# EAGLE design 99 (EAGLE 9.6.1)
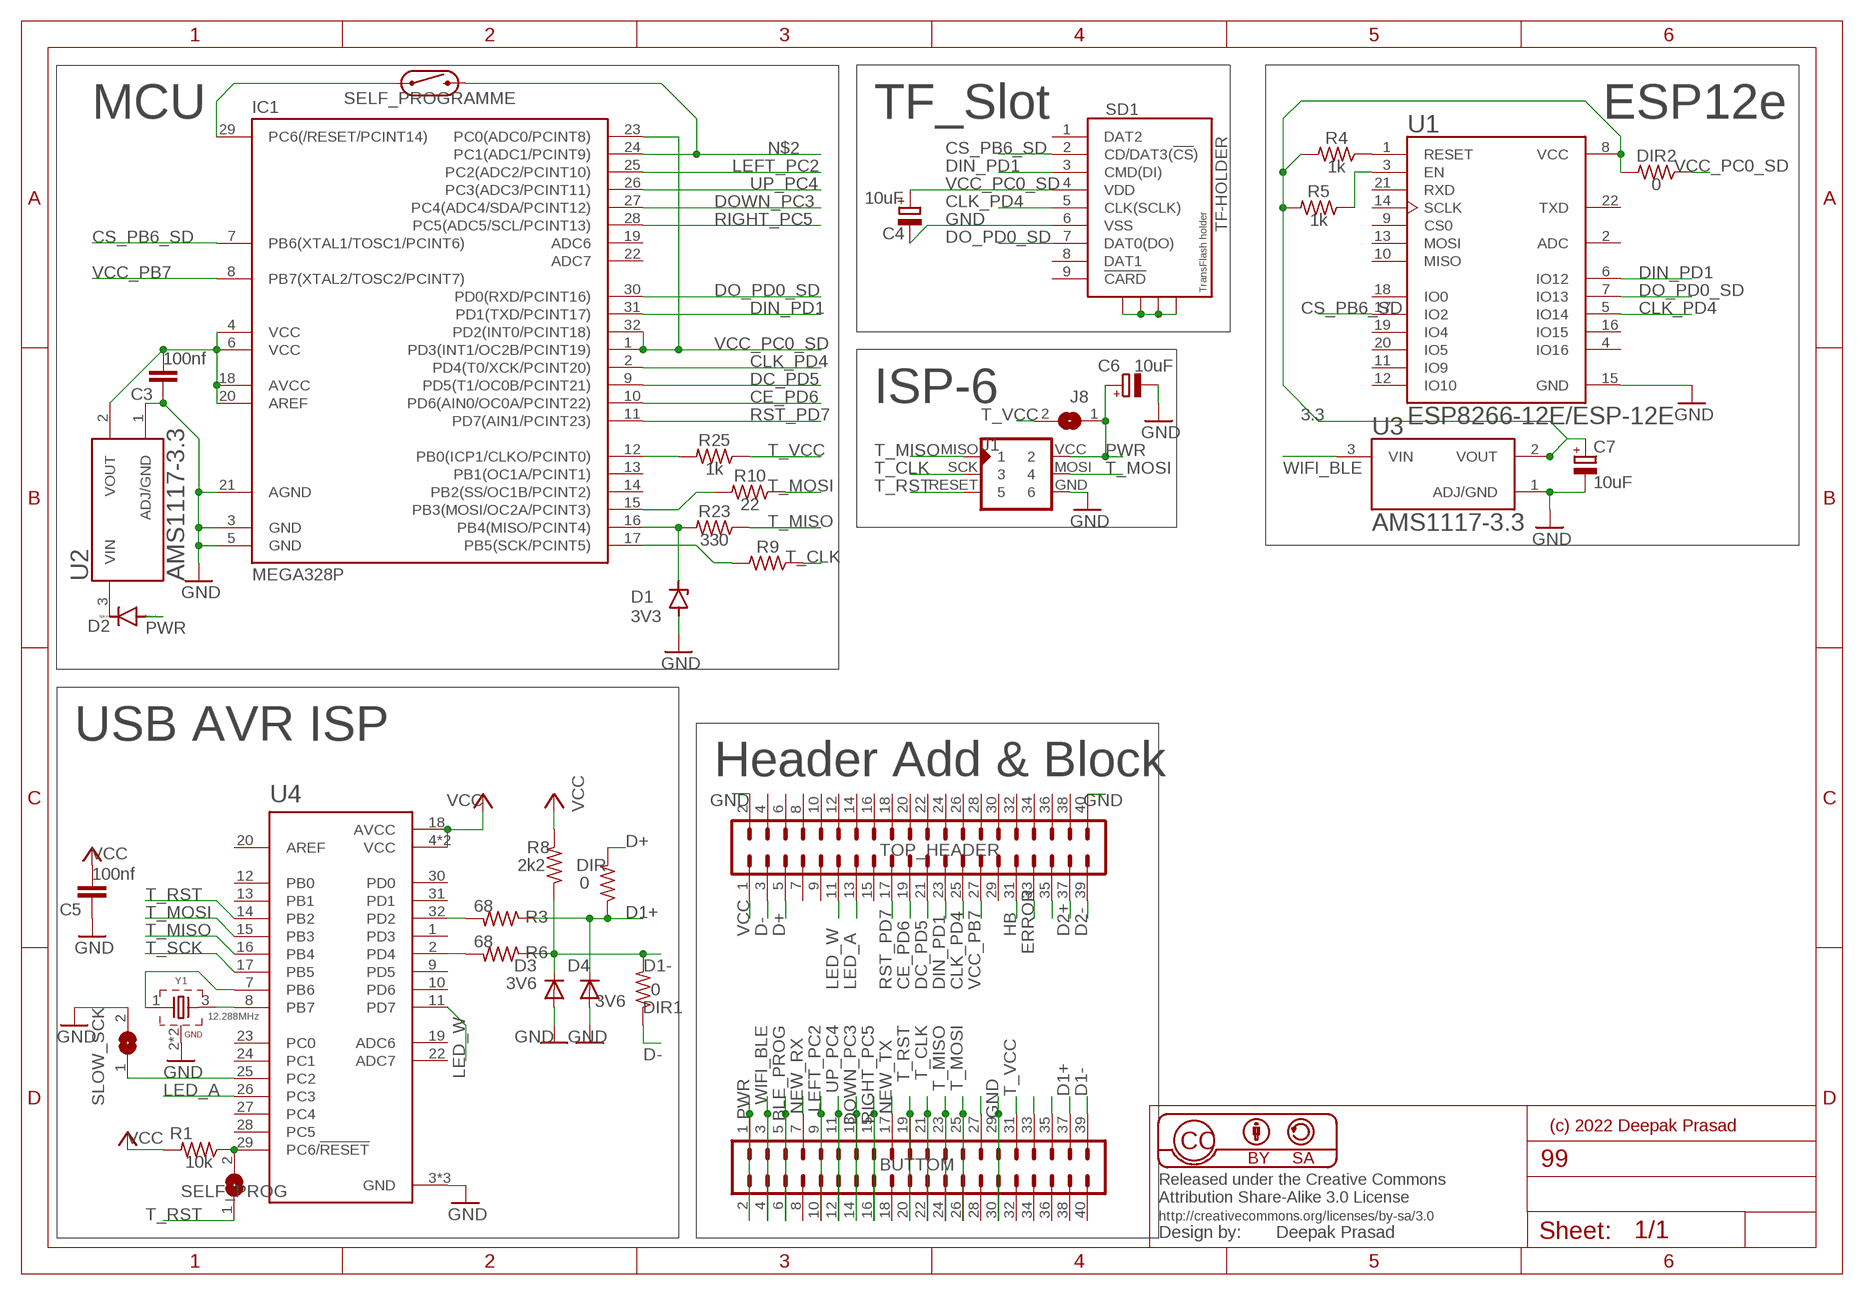
[diagram p0: schematic, sheet 1]

## Parts
BUTTOM  MA20-2  [MA20-2]
C3  100nf  C-EUC1206  [C1206]
C4  10uF  CPOL-EUC/6032-28R  [C/6032-28R]
C5  100nf  C-EUC1206  [C1206]
C6  10uF  CPOL-EUC/6032-28R  [C/6032-28R]
C7  10uF  CPOL-EUC/6032-28R  [C/6032-28R]
D1  3V3  ZENER-DIODESOD80C  [SOD80C]
D2  DIODE-DO214AC  [DO214AC]
D3  3V6  DIODESMA  [SMA-DIODE]
D4  3V6  DIODESMA  [SMA-DIODE]
DIR  0  R-US_CHIP-1206(3216-METRIC)  [RESC3216X70]
DIR1  0  R-US_CHIP-1206(3216-METRIC)  [RESC3216X70]
DIR2  0  R-US_CHIP-1206(3216-METRIC)  [RESC3216X70]
IC1  MEGA328P  MEGA48/88/168-AU  [TQFP32-08]
J1  AVR-ISP-6PINAVR-ISP-6PIN  [AVR-ISP-6PIN]
J8  SJW  [SJW]
R1  10k  R-US_CHIP-1206(3216-METRIC)  [RESC3216X70]
R3  68  R-US_CHIP-1206(3216-METRIC)  [RESC3216X70]
R4  1k  R-US_CHIP-1206(3216-METRIC)  [RESC3216X70]
R5  1k  R-US_CHIP-1206(3216-METRIC)  [RESC3216X70]
R6  68  R-US_CHIP-1206(3216-METRIC)  [RESC3216X70]
R8  2k2  R-US_CHIP-1206(3216-METRIC)  [RESC3216X70]
R9  22  R-US_CHIP-1206(3216-METRIC)  [RESC3216X70]
R10  22  R-US_CHIP-1206(3216-METRIC)  [RESC3216X70]
R23  330  R-US_CHIP-1206(3216-METRIC)  [RESC3216X70]
R25  1k  R-US_CHIP-1206(3216-METRIC)  [RESC3216X70]
SD1  TF-HOLDER  [TF-PULL]
SELF_PROG  SJW  [SJW]
SELF_PROGRAMME  REED_SWITCH-PTH-GLASS  [REED_SWITCH_GLASS]
SLOW_SCK  SJW  [SJW]
TOP_HEADER  MA20-2  [MA20-2]
U1  ESP8266-12E/ESP-12E  [XCVR_ESP8266-12E/ESP-12E]
U2  AMS1117-3.3  [SOT229P700X180-4N]
U3  AMS1117-3.3  [SOT229P700X180-4N]
U4  ATMEGA328P-AU  [QFP80P900X900X120-32N]
Y1  12.288MHz  WE-XTAL_CFPX-104_830059523  [WE-XTAL_CFPX-104]

## Nets
3.3: C7.+ DIR2.2 R4.2 R5.2 U1.8(VCC) U3.2(VOUT)
BLE_PROG: BUTTOM.5 BUTTOM.6
CE_PD6: IC1.10(PD6(AIN0/OC0A/PCINT22)) TOP_HEADER.19
CLK_PD4: IC1.2(PD4(T0/XCK/PCINT20)) SD1.5(CLK(SCLK)) TOP_HEADER.25 U1.5(IO14)
CS_PB6_SD: IC1.7(PB6(XTAL1/TOSC1/PCINT6)) SD1.2(CD/DAT3(!CS!)) U1.17(IO2)
D1+: BUTTOM.37 D4.C DIR.1 R3.1
D1-: BUTTOM.39 D3.C DIR1.2 R6.1 R8.1
D2+: TOP_HEADER.37
D2-: TOP_HEADER.39
D+: DIR.2 TOP_HEADER.5
D-: DIR1.1 TOP_HEADER.3
DC_PD5: IC1.9(PD5(T1/OC0B/PCINT21)) TOP_HEADER.21
DIN_PD1: IC1.31(PD1(TXD/PCINT17)) SD1.3(CMD(DI)) TOP_HEADER.23 U1.6(IO12)
DO_PD0_SD: IC1.30(PD0(RXD/PCINT16)) SD1.7(DAT0(DO)) U1.7(IO13)
DOWN_PC3: BUTTOM.13 BUTTOM.14 IC1.27(PC4(ADC4/SDA/PCINT12))
ERROR: TOP_HEADER.33
GND [POWER]: BUTTOM.29 BUTTOM.30 C3.1 C4.- C5.1 C6.- C7.- D1.A D3.A D4.A IC1.3(GND) IC1.5(GND) IC1.21(AGND) J1.GND SD1.6(VSS) SLOW_SCK.2 TOP_HEADER.2 TOP_HEADER.40 U1.15(GND) U2.1(ADJ/GND) U3.1(ADJ/GND) U4.3(GND) U4.5(GND) U4.21(GND) Y1.2(GND) Y1.4(GND)
GND1: SD1.S1 SD1.S2 SD1.S3 SD1.S4
HB: TOP_HEADER.31
LED_A: TOP_HEADER.13 U4.26(PC3)
LED_W: TOP_HEADER.11 U4.11(PD7)
LEFT_PC2: BUTTOM.9 BUTTOM.10 IC1.25(PC2(ADC2/PCINT10))
N$1: U4.8(PB7) Y1.3
N$2: IC1.24(PC1(ADC1/PCINT9)) SELF_PROGRAMME.P$2
N$3: R4.1 U1.1(RESET)
N$5: R5.1 U1.3(EN)
N$6: IC1.12(PB0(ICP1/CLKO/PCINT0)) R25.2
N$7: D1.C IC1.16(PB4(MISO/PCINT4)) R23.2
N$8: U4.7(PB6) Y1.1
N$9: C3.2 IC1.4(VCC) IC1.6(VCC) IC1.18(AVCC) IC1.20(AREF) U2.2(VOUT)
N$10: R1.1 SELF_PROG.2 U4.29(PC6/!RESET)
N$11: D2.C U2.3(VIN)
N$12: IC1.29(PC6(/RESET/PCINT14)) SELF_PROGRAMME.P$1
N$13: SLOW_SCK.1 U4.25(PC2)
N$16: R3.2 U4.32(PD2)
N$19: R6.2 U4.2(PD4)
N$21: IC1.15(PB3(MOSI/OC2A/PCINT3)) R10.2
N$22: IC1.17(PB5(SCK/PCINT5)) R9.2
N$32: TOP_HEADER.35
N$41: BUTTOM.27
N$44: BUTTOM.33
N$45: BUTTOM.35
NEW_RX: BUTTOM.7
NEW_TX: BUTTOM.17
PWR: BUTTOM.1 BUTTOM.2 C6.+ D2.A J1.VCC J8.1
RIGHT_PC5: BUTTOM.15 BUTTOM.16 IC1.28(PC5(ADC5/SCL/PCINT13))
RST_PD7: IC1.11(PD7(AIN1/PCINT23)) TOP_HEADER.17
T_CLK: BUTTOM.21 BUTTOM.22 J1.SCK R9.1
T_MISO: BUTTOM.23 BUTTOM.24 J1.MISO R23.1 U4.16(PB4)
T_MOSI: BUTTOM.25 BUTTOM.26 J1.MOSI R10.1 U4.15(PB3)
T_RST: BUTTOM.19 BUTTOM.20 J1.RESET SELF_PROG.1 U4.14(PB2)
T_SCK: U4.17(PB5)
T_VCC: BUTTOM.31 J8.2 R25.1
UP_PC4: BUTTOM.11 BUTTOM.12 IC1.26(PC3(ADC3/PCINT11))
VCC [POWER]: C5.2 R1.2 R8.2 TOP_HEADER.1 U4.4(VCC) U4.6(VCC) U4.18(AVCC)
VCC_PB7: IC1.8(PB7(XTAL2/TOSC2/PCINT7)) TOP_HEADER.27
VCC_PC0_SD: C4.+ DIR2.1 IC1.1(PD3(INT1/OC2B/PCINT19)) IC1.23(PC0(ADC0/PCINT8)) IC1.32(PD2(INT0/PCINT18)) SD1.4(VDD)
WIFI_BLE: BUTTOM.3 BUTTOM.4 U3.3(VIN)
Unconnected: BUTTOM.8 BUTTOM.18 BUTTOM.28 BUTTOM.32 BUTTOM.34 BUTTOM.36 BUTTOM.38 BUTTOM.40 IC1.13(PB1(OC1A/PCINT1)) IC1.14(PB2(SS/OC1B/PCINT2)) IC1.19(ADC6) IC1.22(ADC7) SD1.1(DAT2) SD1.8(DAT1) SD1.9(!CARD) TOP_HEADER.4 TOP_HEADER.6 TOP_HEADER.7 TOP_HEADER.8 TOP_HEADER.9 TOP_HEADER.10 TOP_HEADER.12 TOP_HEADER.14 TOP_HEADER.15 TOP_HEADER.16 TOP_HEADER.18 TOP_HEADER.20 TOP_HEADER.22 TOP_HEADER.24 TOP_HEADER.26 TOP_HEADER.28 TOP_HEADER.29 TOP_HEADER.30 TOP_HEADER.32 TOP_HEADER.34 TOP_HEADER.36 TOP_HEADER.38 U1.2(ADC) U1.4(IO16) U1.9(CS0) U1.10(MISO) U1.11(IO9) U1.12(IO10) U1.13(MOSI) U1.14(SCLK) U1.16(IO15) U1.18(IO0) U1.19(IO4) U1.20(IO5) U1.21(RXD) U1.22(TXD) U4.1(PD3) U4.9(PD5) U4.10(PD6) U4.12(PB0) U4.13(PB1) U4.19(ADC6) U4.20(AREF) U4.22(ADC7) U4.23(PC0) U4.24(PC1) U4.27(PC4) U4.28(PC5) U4.30(PD0) U4.31(PD1)

## Notes on the sheet
- MCU | TF_Slot | ESP12e
- ISP-6
- USB AVR ISP
- Header Add & Block
- (c) 2022 Deepak Prasad

## Library data of the parts
BUTTOM TOP_HEADER = con-lstb:MA20-2: PIN HEADER; OC_FARNELL: unknown; OC_NEWARK: unknown
C3 C5 = rcl:C-EU: CAPACITOR, European symbol; SPICEPREFIX: C
C4 C6 C7 = rcl:CPOL-EU: POLARIZED CAPACITOR, European symbol
D1 = diode:ZENER-DIODE: Z-Diode
D2 = diode:DIODE-: DIODE
D3 D4 = sparkfun:DIODE: Diode These are standard reverse protection diodes and small signal diodes. SMA package can handle up to about 1A. SOD-323 can handle about 200mA. What the SOD-323 package when ordering, there are some mfgs out there that are 5-pin packages.
DIR DIR1 DIR2 R1 R3-R6 R8-R10 R23 R25 = Resistor:R-US: Resistor Fixed - ANSI; CATEGORY: Resistor; SUB-CATEGORY: Fixed
IC1 = avr-6:MEGA48/88/168
J1 = avr-isp:AVR-ISP-6PIN: AVR ISP 6pin 3x2 pin header
J8 SELF_PROG SLOW_SCK = jumper:SJ: SMD solder JUMPER
SD1 = sd-mmc:TF-HOLDER: TF / Micro SD socket is PUSH-PUSH type, the card can be pushed into and auto locked and pushed out by simply press the card. Surface Mounting type.
SELF_PROGRAMME = SparkFun-Switches:REED_SWITCH: Reed Switch A reed switch is a magnetically-actuated switch. When the device is exposed to a magnetic field, the two ferrous materials inside the switch pull together and the switch closes. Variant Overview PTH-GLASS Reed Switch <https://www.sparkfun.com/products/8642> (COM-08642) - PTH reed switch w/ glass body (6.0 x 0.9 mm) PTH-INSULATED Reed Switch - Insulated <https://www.sparkfun.com/products/10601> (COM-10601) - PTH reed switch w/ insulated body (15.1 x 4.2 mm); PROD_ID: SWCH-09282; SF_SKU: COM-08642
U1 = ESP8266-12E_ESP-12E:ESP8266-12E/ESP-12E: ESP-12E WiFi Module Check availability <https://pricing.snapeda.com/parts/ESP8266-12E/ESP-12E/AI-Thinker/view-part?ref=eda>; AVAILABILITY: Not in stock; DESCRIPTION: This WiFi module has a 32-bit MCU micro and clock speeds supporting 80 MHz or 160 MHz. Supports the RTOS and integrated Wi-Fi MAC/BB/RF/PA/LNA, and has an on-board antenna.; MF: AI-Thinker; MP: ESP8266-12E/ESP-12E; PACKAGE: None; PRICE: None
U2 U3 = AMS1117-3.3:AMS1117-3.3: Sot223/Pkg 1-Amp 3.3-Volt Low Drop Out Voltage Regulatator Check availability <https://pricing.snapeda.com/parts/AMS1117-3.3/Advanced%20Monolithic%20Systems/view-part?ref=eda>; AVAILABILITY: In Stock; DESCRIPTION: Sot223/Pkg 1-Amp 3.3-Volt Low Drop Out Voltage Regulatator; MF: Advanced Monolithic Systems; MP: AMS1117-3.3; PACKAGE: SOT-223 Seeed Technology; PRICE: None
U4 = ATMEGA328P-AU:ATMEGA328P-AU: ATmega Series 20 MHz 32 KB Flash 2 KB SRAM 8-Bit Microcontroller - TQFP-32 Check availability <https://pricing.snapeda.com/parts/ATMEGA328P-AU/Microchip%20Technology/view-part?ref=eda>; AVAILABILITY: In Stock; DESCRIPTION: AVR AVR® ATmega Microcontroller IC 8-Bit 20MHz 32KB (16K x 16) FLASH 32-TQFP (7x7); MF: Microchip Technology; MP: ATMEGA328P-AU; PACKAGE: TQFP-32 Microchip; PRICE: None; PURCHASE-URL: https://pricing.snapeda.com/search/part/ATMEGA328P-AU/?ref=eda
Y1 = Wurth_Quartz Crystals & Oscillators_WE-XTAL:WE-XTAL_CFPX-104: WE-XTAL Quartz Crystal Characteristics SMT and THT models Hermetically sealed Frequencies between 1.8432 MHz and 50 MHz Tolerances down to ±10 ppm available Maximum operating temperatures range: -40 °C to 85 °C Stabilities down to ±10 ppm available Applications Microprocessor Wireless Communication Devices Industrial Devices Wired Communication (e.g. Ethernet and USB) IoT Optical Network Audio and Multimedia Devices Test and Measurement Equipment Navigation and Locators Wearables <https://www.we-online.com/catalog/media/o135919v209%20Family_WE-XTAL_IQXC-42.jpg> Details see: https://www.we-online.com/catalog/en/WE-XTAL Updated by Ella Wu , 2020-11-23 2020 (C) Wurth Elektronik; C-LOAD: 18pF; DATASHEET-URL: https://www.we-online.com/catalog/datasheet/830059523.pdf; MOUNT: SMT; PART-NUMBER: 830059523; STABILITY: 30ppm; TOLERANCE: ±20ppm

## Net classes
0 default: width 0.254 mm, clearance 0.254 mm
1 POWER: width 0.254 mm, clearance 0.254 mm

## Board
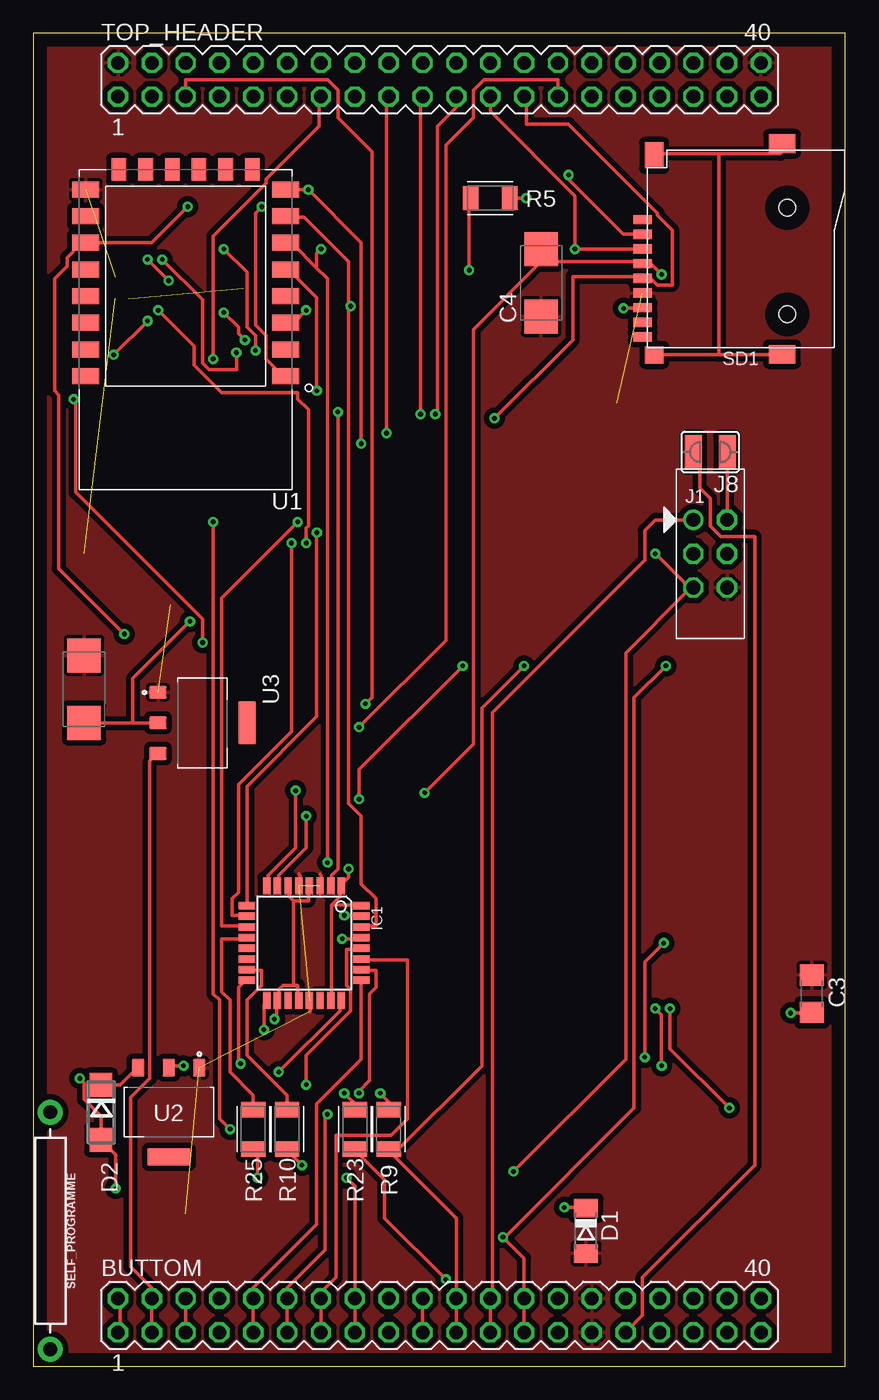
[diagram p1: board, top side]
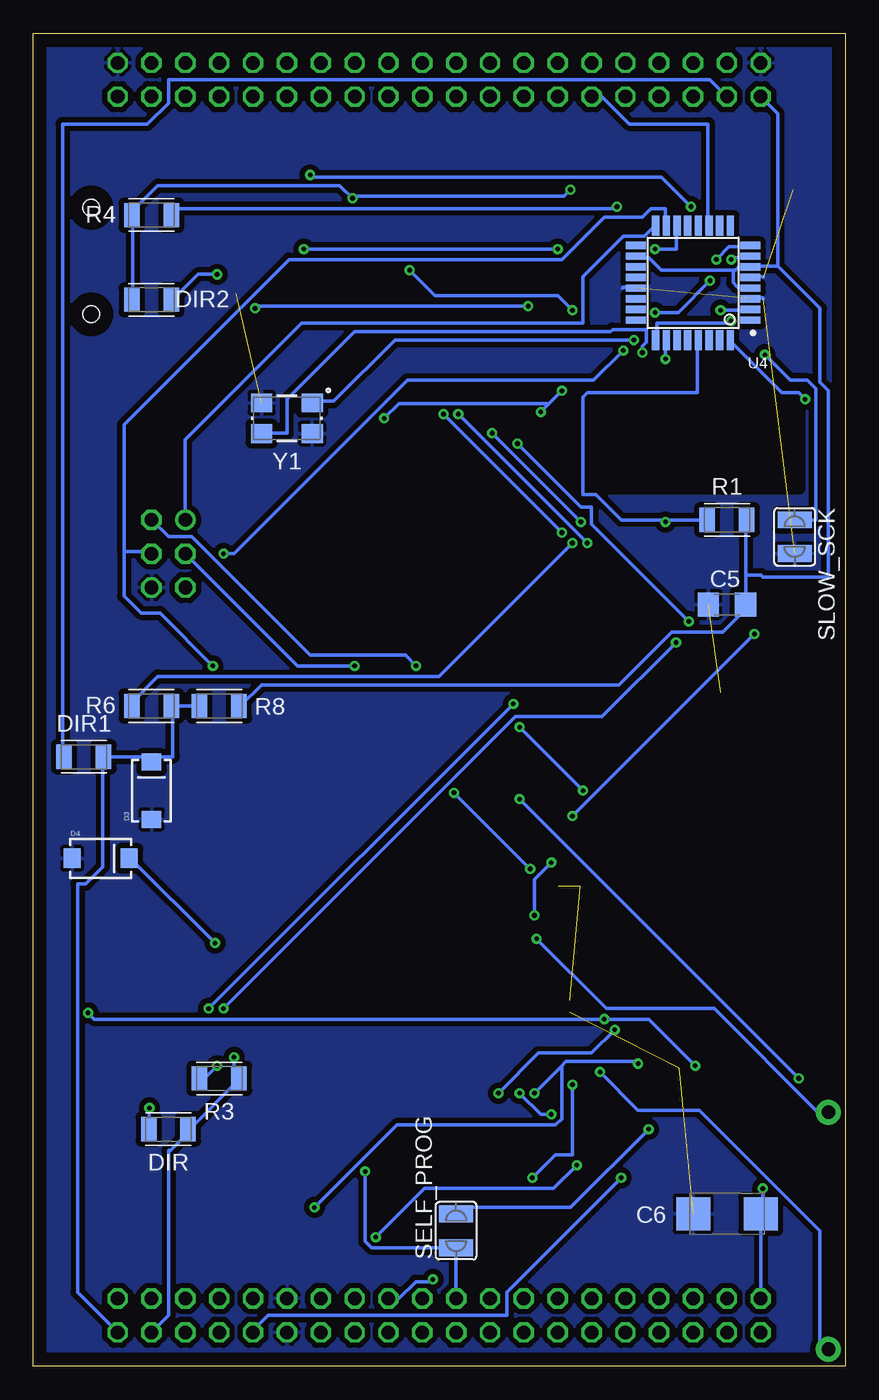
[diagram p2: board, bottom side, seen from below]

Size 60.94 x 100 mm. Coordinates in mm from the lower left corner, seen from the top.
Outline: 0,0 60.94,0 60.94,100 0,100 0,0
Copper layers (1*16): Top 0.035mm / dielectric 1.5mm / Bottom 0.035mm
Design rules "default": minimum track width 6mil, minimum drill 0.35mm, track to track 6mil, track to pad 6mil, pad to pad 6mil, via to via 6mil, smd to smd 6mil, copper to edge 40mil, drill to drill 6mil, minimum pad ring 10mil, minimum via ring 8mil, stop-mask expansion 4mil, vias tented up to drill 0mil, thermal gap 10mil

### Footprints (pad centres in the part's own frame; a part is rotated, then mirrored left to right if it is on the bottom)
MA20-2 = drill 1.016 octagon: 1 -24.13,-1.27; 2 -24.13,1.27; 3 -21.59,-1.27; 4 -21.59,1.27; 5 -19.05,-1.27; 6 -19.05,1.27; 7 -16.51,-1.27; 8 -16.51,1.27; 9 -13.97,-1.27; 10 -13.97,1.27; 11 -11.43,-1.27; 12 -11.43,1.27; 13 -8.89,-1.27; 14 -8.89,1.27; 15 -6.35,-1.27; 16 -6.35,1.27; 17 -3.81,-1.27; 18 -3.81,1.27; 19 -1.27,-1.27; 20 -1.27,1.27; 21 1.27,-1.27; 22 1.27,1.27; 23 3.81,-1.27; 24 3.81,1.27; 25 6.35,-1.27; 26 6.35,1.27; 27 8.89,-1.27; 28 8.89,1.27; 29 11.43,-1.27; 30 11.43,1.27; 31 13.97,-1.27; 32 13.97,1.27; 33 16.51,-1.27; 34 16.51,1.27; 35 19.05,-1.27; 36 19.05,1.27; 37 21.59,-1.27; 38 21.59,1.27; 39 24.13,-1.27; 40 24.13,1.27
C1206 = smd 1.6 x 1.8: 1 -1.4,0; 2 1.4,0
C/6032-28R = smd 2.55 x 2.5: + 2.525,0; - -2.525,0
SOD80C = smd 1.4 x 1.8: A 1.7,0; C -1.7,0
DO214AC = smd 1.8 x 1.7: A 2.05,0; C -2.05,0
SMA-DIODE = smd 1.27 x 1.47: A -2.15,0; C 2.15,0
RESC3216X70 = smd 1.165 x 1.815: 1 -1.475,0; 2 1.475,0
TQFP32-08 = smd 1.27 x 0.559: 1 -4.293,2.8; 2 -4.293,2; 3 -4.293,1.2; 4 -4.293,0.4; 5 -4.293,-0.4; 6 -4.293,-1.2; 7 -4.293,-2; 8 -4.293,-2.8; 17 4.293,-2.8; 18 4.293,-2; 19 4.293,-1.2; 20 4.293,-0.4; 21 4.293,0.4; 22 4.293,1.2; 23 4.293,2; 24 4.293,2.8 | smd 0.559 x 1.27: 9 -2.8,-4.293; 10 -2,-4.293; 11 -1.2,-4.293; 12 -0.4,-4.293; 13 0.4,-4.293; 14 1.2,-4.293; 15 2,-4.293; 16 2.8,-4.293; 25 2.8,4.293; 26 2,4.293; 27 1.2,4.293; 28 0.4,4.293; 29 -0.4,4.293; 30 -1.2,4.293; 31 -2,4.293; 32 -2.8,4.293
AVR-ISP-6PIN = drill 1.016 octagon: GND 1.27,-2.54; MOSI 1.27,0; RESET -1.27,-2.54; SCK -1.27,0; VCC 1.27,2.54 | drill 1.016: MISO -1.27,2.54
SJW = smd 1.27 x 2.54: 1 -1.27,0; 2 1.27,0
TF-PULL = smd 0.7 x 1.4: 1 -2.2,-7.62; 2 -1.1,-7.62; 3 0,-7.62; 4 1.1,-7.62; 5 2.2,-7.62; 6 3.3,-7.62; 7 4.4,-7.62; 8 5.5,-7.62; 9 6.6,-7.62 | smd 1.4 x 2: S1 -7.9,2.85; S2 7.9,2.85 | smd 1.28 x 1.4: S3 7.96,-6.75 | smd 1.95 x 1.4: S4 -7.025,-6.75 | hole 1.25: -3.1,3.25; 4.9,3.25
REED_SWITCH_GLASS = drill 1.016 pad 1.88: P$1 -8.89,0; P$2 8.89,0
XCVR_ESP8266-12E/ESP-12E = smd 2 x 1.2: 1 -7.5,7; 2 -7.5,5; 3 -7.5,3; 4 -7.5,1; 5 -7.5,-1; 6 -7.5,-3; 7 -7.5,-5; 8 -7.5,-7; 15 7.5,-7; 16 7.5,-5; 17 7.5,-3; 18 7.5,-1; 19 7.5,1; 20 7.5,3; 21 7.5,5; 22 7.5,7 | smd 1.1 x 1.7: 9 -5,-8.5; 10 -3,-8.5; 11 -1,-8.5; 12 1,-8.5; 13 3,-8.5; 14 5,-8.5
SOT229P700X180-4N = smd 0.93 x 1.31: 1 -2.29,-3.345; 2 0,-3.345; 3 2.29,-3.345 | smd 3.24 x 1.31: 4 0,3.345
QFP80P900X900X120-32N = smd 1.5 x 0.55: 1 -4.3,2.8; 2 -4.3,2; 3 -4.3,1.2; 4 -4.3,0.4; 5 -4.3,-0.4; 6 -4.3,-1.2; 7 -4.3,-2; 8 -4.3,-2.8; 17 4.3,-2.8; 18 4.3,-2; 19 4.3,-1.2; 20 4.3,-0.4; 21 4.3,0.4; 22 4.3,1.2; 23 4.3,2; 24 4.3,2.8 | smd 0.55 x 1.5: 9 -2.8,-4.3; 10 -2,-4.3; 11 -1.2,-4.3; 12 -0.4,-4.3; 13 0.4,-4.3; 14 1.2,-4.3; 15 2,-4.3; 16 2.8,-4.3; 25 2.8,4.3; 26 2,4.3; 27 1.2,4.3; 28 0.4,4.3; 29 -0.4,4.3; 30 -1.2,4.3; 31 -2,4.3; 32 -2.8,4.3
WE-XTAL_CFPX-104 = smd 1.6 x 1.4: 1 -1.9,-1.15; 2 1.9,-1.15; 3 1.9,1.15; 4 -1.9,1.15

### Placement (x,y rotation side)
BUTTOM  30.48,3.81 0 top
C3  58.42,27.94 270 top
C4  38.1,81.28 90 top
C5  8.89,57.15 0 bottom
C6  8.89,11.43 0 bottom
C7  3.81,50.8 270 top
D1  41.48,10.16 270 top
D2  5.08,19.05 270 top
D3  52.07,43.18 90 bottom
D4  55.88,38.1 0 bottom
DIR  50.8,17.78 180 bottom
DIR1  57.15,45.72 0 bottom
DIR2  52.07,80.01 180 bottom
IC1  20.32,31.75 270 top
J1  50.8,60.96 0 top
J8  50.8,68.58 180 top
R1  8.89,63.5 0 bottom
R3  46.99,21.59 180 bottom
R4  52.07,86.36 180 bottom
R5  34.29,87.63 0 top
R6  52.07,49.53 180 bottom
R8  46.99,49.53 0 bottom
R9  26.67,17.78 90 top
R10  19.05,17.78 90 top
R23  24.13,17.78 90 top
R25  16.51,17.78 90 top
SD1  53.34,83.82 270 top
SELF_PROG  29.21,10.16 90 bottom
SELF_PROGRAMME  1.27,10.16 270 top
SLOW_SCK  3.81,62.23 270 bottom
TOP_HEADER  30.48,96.52 0 top
U1  11.43,81.28 180 top
U2  10.16,19.05 180 top
U3  12.7,48.26 270 top
U4  11.43,81.28 180 bottom
Y1  41.91,71.12 180 bottom

### Tracks (layer width: path | path; a pad name or v marks a point on that pad's centre or on a via)
3.3  (via drill 0.35)
  Top 0.254: 7.46,48.26 C7.+ | 7.46,48.26 U3.2 | v36.99,87.63 R5.2 | U1.8 19.05,88.27 v20.64,88.27 24.61,84.3 v24.61,69.22 | 7.46,48.26 7.46,51.59 v11.75,55.88
  Bottom 0.254: 53.5,86.36 53.5,86.68 51.59,88.58 37.94,88.58 v36.99,87.63 36.99,87.79 21.11,87.79 v20.64,88.27 | 53.5,86.36 53.5,80.01 DIR2.2 | 53.5,86.36 R4.2 | v11.75,55.88 19.05,63.18 19.05,64.45 19.84,64.45 v24.61,69.22
BLE_PROG
  Top 0.254: BUTTOM.6 BUTTOM.5
CE_PD6  (via drill 0.35)
  Top 0.254: v19.37,61.75 19.37,47.62 15.4,43.66 15.4,35.56 14.92,35.08 14.92,33.81 15.88,33.81 IC1.10 | v29.05,71.44 29.05,95.09 TOP_HEADER.19
  Bottom 0.254: v29.05,71.44 v19.37,61.75
CLK_PD4  (via drill 0.35)
  Top 0.254: TOP_HEADER.25 36.99,95.09 36.99,93.19 40.16,93.19 46.83,86.52 46.83,86.36 47.94,85.25 47.94,81.12 46.83,81.12 46.35,81.6 45.72,81.6 SD1.5 45.72,81.76 40.48,81.76 40.48,76.99 v34.61,71.12 | v22.86,71.6 22.86,37.31 22.38,36.83 22.38,36.2 IC1.2 | v21.27,73.18 21.27,80.17 19.05,82.39 U1.5
  Bottom 0.254: v21.27,73.18 22.3,72.15 | 22.3,72.15 v22.86,71.6 | v34.61,71.12 33.5,72.23 22.38,72.23 22.3,72.15
CS_PB6_SD  (via drill 0.35)
  Top 0.254: v20.48,41.27 20.48,38.89 18.41,36.83 18.41,36.2 IC1.7 | v6.83,54.93 1.91,59.85 1.91,72.87 1.59,73.18 1.59,81.6 2.54,82.55 2.54,83.19 3.49,84.14 3.81,84.14 U1.17 3.97,84.3 8.89,84.3 v11.59,87 | v40.16,89.38 40.16,89.06 44.29,84.93 SD1.2
  Bottom 0.254: v6.83,54.93 v20.48,41.27 | v40.16,89.38 40.01,89.22 13.81,89.22 v11.59,87
D1+  (via drill 0.35)
  Top 0.254: v47.31,31.75 45.88,30.32 v45.88,23.18
  Bottom 0.254: v47.31,31.75 53.66,38.1 D4.C | v45.88,23.18 45.88,21.59 R3.1 45.4,21.59 49.21,17.78 DIR.1 49.05,17.78 50.64,16.19 50.8,16.19 50.8,3.81 BUTTOM.37
D1-
  Bottom 0.254: 50.48,49.53 R8.1 | 50.48,49.53 50.48,45.72 52.23,45.72 D3.C 52.07,45.4 52.39,45.72 DIR1.2 55.72,45.72 55.72,37.47 56.99,36.2 57.63,36.2 57.63,5.56 BUTTOM.39 | 50.48,49.53 R6.1
D+  (via drill 0.35)
  Top 0.254: v52.23,19.37 47.78,23.81 v47.78,26.83 | v24.92,49.69 25.4,50.16 25.4,91.12 22.86,93.66 22.86,95.73 22.07,96.52 11.43,96.52 TOP_HEADER.5
  Bottom 0.254: v52.23,19.37 52.23,17.78 DIR.2 | v24.92,49.69 v47.78,26.83
D-
  Bottom 0.254: TOP_HEADER.3 10.16,96.52 50.8,96.52 50.8,94.77 52.39,93.19 58.74,93.19 58.74,45.72 DIR1.1
DC_PD5  (via drill 0.35)
  Top 0.254: v21.27,62.55 21.27,48.74 16.03,43.5 16.03,34.61 IC1.9 | v30.16,71.44 30.32,71.6 30.32,93.03 31.75,94.46 TOP_HEADER.21
  Bottom 0.254: v30.16,71.44 v21.27,62.55
DIN_PD1  (via drill 0.35)
  Top 0.254: SD1.3 v40.64,83.82 40.64,87.79 34.29,94.14 TOP_HEADER.23 | v23.34,33.81 24.61,33.81 IC1.31 | v22.07,37.78 22.07,81.6 21.19,82.47 | 21.19,82.47 19.53,84.14 19.05,84.14 U1.6 | v21.59,83.82 21.27,83.5 21.27,82.55 21.19,82.47
  Bottom 0.254: v23.34,33.81 23.34,36.51 v22.07,37.78 | v21.59,83.82 v40.64,83.82
DO_PD0_SD  (via drill 0.35)
  Top 0.254: 23.65,79.53 23.65,82.87 20.32,86.2 19.05,86.2 U1.7 | 23.65,79.53 23.65,42.23 24.61,41.27 24.61,36.2 25.72,35.08 25.72,33.02 24.77,33.02 IC1.30 | v44.29,79.38 45.72,79.38 SD1.7 | 23.65,79.53 v23.81,79.53
  Bottom 0.254: v44.29,79.38 44.13,79.53 v23.81,79.53
DOWN_PC3
  Top 0.254: IC1.27 24.77,30.48 28.1,30.48 28.1,18.57 26.83,17.3 22.7,17.3 22.7,6.67 21.59,5.56 BUTTOM.14 BUTTOM.13
GND  (9 unrouted)
  Top 0.254: IC1.21 20.8,27.3 20.8,26.67 20.72,26.59 | IC1.5 20,36.2 20,36.83 19.93,36.92 | IC1.3 21.59,36.2 21.59,36.83 21.53,36.92
  Bottom 0.254: U4.3 6.99,80.17 6.19,80.17 6.14,80.09 | U4.5 6.99,81.76 6.19,81.76 6.14,81.69 | U4.21 15.88,80.96 16.67,80.96 16.72,80.87
  pour Top (isolate 0.406): -1.27,101.6 -1.27,-1.27 60.96,-1.27 62.23,0 62.23,100.33 60.96,101.6
  pour Bottom (isolate 0.406): -1.27,101.6 -1.27,-1.27 60.96,-1.27 62.23,0 62.23,100.33 60.96,101.6 0,101.6
GND1
  Top 0.254: 51.44,75.88 56.04,75.88 SD1.S2 | 51.44,75.88 46.67,75.88 SD1.S3 | 51.44,90.96 56.04,90.96 56.04,91.6 SD1.S1 | 51.44,90.96 46.67,90.96 SD1.S4 | 51.44,90.96 51.44,75.88
LED_A  (via drill 0.35)
  Top 0.254: v13.49,75.56 13.49,84.77 17.46,88.74 17.46,89.06 21.43,93.03 21.43,95.09 TOP_HEADER.13
  Bottom 0.254: v13.49,75.56 13.49,76.83 U4.26
LED_W
  Bottom 0.254: TOP_HEADER.11 18.26,95.25 16.19,93.19 10.32,93.19 10.32,85.72 U4.11
LEFT_PC2
  Top 0.254: IC1.25 24.61,28.89 24.61,23.02 21.27,19.68 21.27,10.64 16.51,5.87 BUTTOM.10 BUTTOM.9
N$1  (via drill 0.35)
  Top 0.254: v9.68,83.03 12.7,80.01 12.7,75.25 13.18,74.77 15.24,74.77 v15.24,76.04
  Bottom 0.254: v9.68,83.03 8.73,83.98 7.14,83.98 U4.8 | v15.24,76.04 15.24,76.52 14.92,76.83 14.92,77.79 17.46,77.79 17.62,77.63 36.83,77.63 41.91,72.55 41.91,70.01 43.66,70.01 Y1.3
N$2  (via drill 0.35)
  Top 0.254: v18.41,22.07 23.02,26.67 23.02,27.3 IC1.24
  Bottom 0.254: v18.41,22.07 15.56,19.21 10.95,19.21 1.91,10.16 1.91,1.27 SELF_PROGRAMME.P$2
N$3  (via drill 0.35)
  Top 0.254: v17.14,87 16.67,86.52 16.67,78.11 17.46,77.31 17.46,75.56 18.89,74.14 U1.1
  Bottom 0.254: v17.14,87 17.3,86.84 50.01,86.84 50.48,86.36 R4.1
N$5  (via drill 0.35)
  Top 0.254: v32.7,82.23 32.7,87.63 R5.1 | v20.48,79.22 19.68,78.42 19.05,78.42 U1.3
  Bottom 0.254: v32.7,82.23 30.8,80.33 21.59,80.33 v20.48,79.22
N$6
  Top 0.254: R25.2 16.51,20.32 14.76,22.07 14.76,27.46 14.13,28.1 14.13,32.07 15.88,32.07 IC1.12
N$7  (via drill 0.35)
  Top 0.254: v15.56,22.7 15.4,22.86 15.4,28.42 15.88,28.89 IC1.16 | v23.34,20.48 24.13,19.68 R23.2 | v39.85,11.91 41.43,11.91 D1.C
  Bottom 0.254: v15.56,22.7 15.72,22.86 20.95,22.86 21.35,22.46 | v23.34,20.48 21.35,22.46 | v39.85,11.91 33.66,18.1 21.75,18.1 21.27,18.57 21.27,22.38 21.35,22.46
N$8  (via drill 0.35)
  Top 0.254: v10.16,81.44 v8.57,83.03 | v14.29,79.06 15.4,77.95 15.4,77.47 v15.88,76.99
  Bottom 0.254: v8.57,83.03 8.41,83.19 7.14,83.19 U4.7 | v10.16,81.44 12.54,79.06 v14.29,79.06 | v15.88,76.99 33.81,76.99 38.42,72.39 40.01,72.39 Y1.1
N$9  (via drill 0.35)
  Top 0.254: 19.53,34.92 19.21,35.24 19.21,36.04 IC1.6 | 19.53,34.92 20.64,34.92 20.64,36.04 IC1.4 | 19.53,28.57 19.84,28.57 19.84,27.46 IC1.20 | 19.53,28.57 18.73,28.57 18.41,28.26 18.41,27.46 IC1.18 18.26,27.3 18.26,26.19 v18.1,26.04 | v11.27,22.54 10.16,22.54 U2.2 | v56.83,26.51 58.42,26.51 C3.2 | 19.53,28.57 19.53,34.92
  Bottom 0.254: v11.27,22.54 14.76,26.04 v18.1,26.04 56.36,26.04 v56.83,26.51
N$10  (via drill 0.35)
  Top 0.254: v14.76,17.78 13.97,18.57 13.97,27.46 13.49,27.94 v13.49,63.34
  Bottom 0.254: R1.1 13.49,63.5 | 13.49,63.5 16.83,63.5 18.73,65.41 19.68,65.41 19.68,72.71 19.37,73.03 11.11,73.03 11.11,76.83 U4.29 | SELF_PROG.2 28.73,11.91 20.64,11.91 v14.76,17.78 | 13.49,63.5 v13.49,63.34
N$11
  Top 0.254: U2.3 7.78,22.38 6.51,21.11 5.08,21.11 D2.C
N$12  (via drill 0.35)
  Top 0.254: v23.18,32.07 24.61,32.07 IC1.29
  Bottom 0.254: v23.18,32.07 17.94,26.83 9.84,26.83 2.06,19.05 SELF_PROGRAMME.P$1
N$13  (via drill 0.35)
  Top 0.254: v6.03,75.88 v8.57,78.42
  Bottom 0.254: v8.57,78.42 8.73,78.26 14.13,78.26 14.13,76.99 U4.25 | v6.03,75.88 4.13,73.98 2.86,73.98 2.22,73.34 2.22,63.5 SLOW_SCK.1
N$16  (via drill 0.35)
  Top 0.254: v3.02,72.55 3.17,72.39 3.17,65.56 12.7,56.04 v12.7,54.29 | v46.67,26.83 47.15,26.35 v47.15,22.54
  Bottom 0.254: v3.02,72.55 3.49,73.03 4.76,73.03 8.57,76.83 U4.32 | v12.7,54.29 18.26,48.74 24.77,48.74 v46.67,26.83 | v47.15,22.54 48.1,21.59 R3.2
N$19  (via drill 0.35)
  Top 0.254: v9.37,79.22 12.06,76.52 12.06,75.09 14.13,73.03 19.84,73.03 19.84,72.55 20.64,71.75 20.64,63.02 20.48,62.87 v20.48,61.75
  Bottom 0.254: v9.37,79.22 7.14,79.22 U4.2 | v20.48,61.75 30.48,51.75 51.59,51.75 53.5,49.85 53.5,49.53 R6.2
N$21
  Top 0.254: R10.2 19.05,20.32 16.03,23.34 16.03,27.46 17.14,28.57 17.14,29.69 16.03,29.69 IC1.15
N$22  (via drill 0.35)
  Top 0.254: v17.3,25.24 17.3,27.15 17.46,27.3 IC1.17 | v26.04,20.48 26.67,19.84 R9.2
  Bottom 0.254: v17.3,25.24 19.05,23.5 23.02,23.5 v26.04,20.48
PWR  (via drill 0.35)
  Top 0.254: J1.VCC J8.1 | BUTTOM.1 6.51,2.7 6.51,4.92 BUTTOM.2 | v6.19,13.34 6.19,15.88 5.08,16.99 D2.A 5.08,18.73 3.81,20 3.81,21.27 v3.49,21.59 | v32.23,52.55 24.45,44.77 v24.45,42.55
  Bottom 0.254: v6.19,13.34 6.19,11.43 6.35,11.43 | 6.35,11.43 BUTTOM.2 | 6.35,11.43 C6.+ | J1.VCC 50.8,62.23 49.05,62.23 40.16,53.34 33.02,53.34 v32.23,52.55 | v3.49,21.59 v24.45,42.55
RIGHT_PC5  (via drill 0.35)
  Top 0.254: v20.48,21.11 20.48,23.34 23.81,26.67 23.81,28.26 23.5,28.57 23.5,31.27 24.61,31.27 IC1.28 | v23.5,14.13 24.13,13.49 BUTTOM.16 BUTTOM.15
  Bottom 0.254: v20.48,21.11 20.48,15.88 21.75,15.88 v23.5,14.13
RST_PD7  (via drill 0.35)
  Top 0.254: v19.84,63.34 14.13,57.63 14.13,33.02 15.88,33.02 IC1.11 | v26.51,70.01 26.51,95.09 TOP_HEADER.17
  Bottom 0.254: v26.51,70.01 v19.84,63.34
T_CLK  (via drill 0.35)
  Top 0.254: BUTTOM.21 BUTTOM.22 31.75,11.11 26.67,16.19 R9.1 27.15,15.88 27.15,16.03 33.66,22.54 33.66,49.37 v36.83,52.55
  Bottom 0.254: J1.SCK 41.12,52.55 v36.83,52.55
T_MISO  (via drill 0.35)
  Top 0.254: v30.96,6.51 26.35,11.11 26.35,13.97 24.13,16.19 R23.1 | BUTTOM.23 BUTTOM.24 34.45,5.24 34.45,49.05 45.88,60.48 45.88,62.71 46.67,63.5 J1.MISO
  Bottom 0.254: v30.96,6.51 31.11,6.35 32.23,6.35 33.5,5.08 BUTTOM.24 | J1.MISO 49.53,69.53 40.8,78.26 19.68,78.26 19.68,81.76 16.67,84.77 15.08,84.77 14.29,85.57 U4.16
T_MOSI  (via drill 0.35)
  Top 0.254: v20.16,15.08 19.05,16.19 R10.1 | BUTTOM.25 BUTTOM.26 36.83,8.1 v35.24,9.68 35.4,9.68 45.09,19.37 45.09,50.16 v47.47,52.55
  Bottom 0.254: v20.16,15.08 21.91,13.34 31.59,13.34 v35.24,9.68 | 54.13,61.12 54.13,70.64 41.75,83.03 21.27,83.03 18.1,86.2 15.24,86.2 14.61,86.84 13.49,86.84 13.49,85.72 U4.15 | 54.13,61.12 52.23,61.12 J1.MOSI | v47.47,52.55 51.44,56.52 52.86,56.52 54.13,57.78 54.13,61.12
T_RST  (via drill 0.35)
  Top 0.254: BUTTOM.20 BUTTOM.19 | v14.29,83.82 16.03,82.07 16.03,77.95 16.67,77.31 v16.67,76.2 | v46.67,60.96 49.21,58.42 J1.RESET 49.05,58.42 49.05,58.1 44.45,53.5 44.45,23.02 v36.04,14.61
  Bottom 0.254: BUTTOM.20 SELF_PROG.1 35.56,8.89 36.04,9.37 v36.04,14.61 | v14.29,83.82 12.7,83.82 12.7,85.57 U4.14 | v16.67,76.2 18.89,73.98 32.86,73.98 45.88,60.96 v46.67,60.96
T_VCC  (via drill 0.35)
  Top 0.254: v16.83,14.13 16.83,15.88 16.51,16.19 R25.1 | J8.2 50.01,68.1 50.01,65.88 50.8,65.09 50.8,63.02 51.59,62.23 54.13,62.23 54.13,15.08 45.72,6.67 45.72,3.81 BUTTOM.31
  Bottom 0.254: v16.83,14.13 25.4,5.56 25.4,3.81 43.34,3.81 44.45,2.7 BUTTOM.31
UP_PC4  (via drill 0.35)
  Top 0.254: v24.45,20.48 24.45,20.64 25.24,21.43 25.24,27.94 25.72,28.42 25.72,29.69 24.77,29.69 IC1.26 | v22.07,18.89 21.91,18.73 21.91,8.73 19.05,5.87 BUTTOM.12 BUTTOM.11
  Bottom 0.254: v24.45,20.48 22.86,18.89 v22.07,18.89
VCC
  Bottom 0.254: 8.41,82.23 8.41,81.28 8.1,80.96 7.14,80.96 U4.4 | 8.41,82.23 8.26,82.23 8.1,82.39 7.14,82.39 U4.6 6.99,82.55 5.08,82.55 | 8.41,82.23 13.81,82.23 14.76,83.19 15.72,83.19 U4.18 | TOP_HEADER.1 5.08,93.98 5.08,82.55 | 7.46,59.37 7.46,63.5 R1.2 | 7.46,59.37 7.46,57.15 C5.2 7.62,57.15 7.62,56.67 9.21,55.09 13.02,55.09 16.99,51.12 43.81,51.12 45.4,49.53 R8.2 | 5.08,82.55 1.91,79.38 1.91,73.82 1.27,73.18 1.27,59.21 6.19,59.21 6.35,59.37 7.46,59.37
VCC_PB7  (via drill 0.35)
  Top 0.254: v19.68,43.18 19.68,38.89 17.62,36.83 17.62,36.2 IC1.8 | v24.45,47.94 30.96,54.45 30.96,91.6 33.02,93.66 33.02,95.73 33.81,96.52 39.37,96.52 TOP_HEADER.27
  Bottom 0.254: v24.45,47.94 v19.68,43.18
VCC_PC0_SD  (via drill 0.35)
  Top 0.254: 22.46,34.69 23.02,35.24 23.02,36.04 IC1.1 23.18,36.2 23.65,36.67 v23.65,37.31 | 22.46,34.69 22.38,34.61 22.38,27.46 IC1.23 | IC1.32 24.61,34.61 22.54,34.61 22.46,34.69 | 38.1,82.87 45.72,82.87 SD1.4 46.35,82.71 v47.15,81.92 | 38.1,82.87 C4.+ 38.1,83.66 | v29.37,43.02 33.02,46.67 33.02,77.79 38.1,82.87
  Bottom 0.254: v47.15,81.92 48.58,81.92 50.48,80.01 DIR2.1 | v29.37,43.02 v23.65,37.31
WIFI_BLE
  Top 0.254: U3.3 9.21,45.88 8.73,45.4 8.73,21.59 7.3,20.16 7.3,7.46 8.89,5.87 BUTTOM.4 BUTTOM.3